# EAGLE design Amplifier (EAGLE 9.3.1)
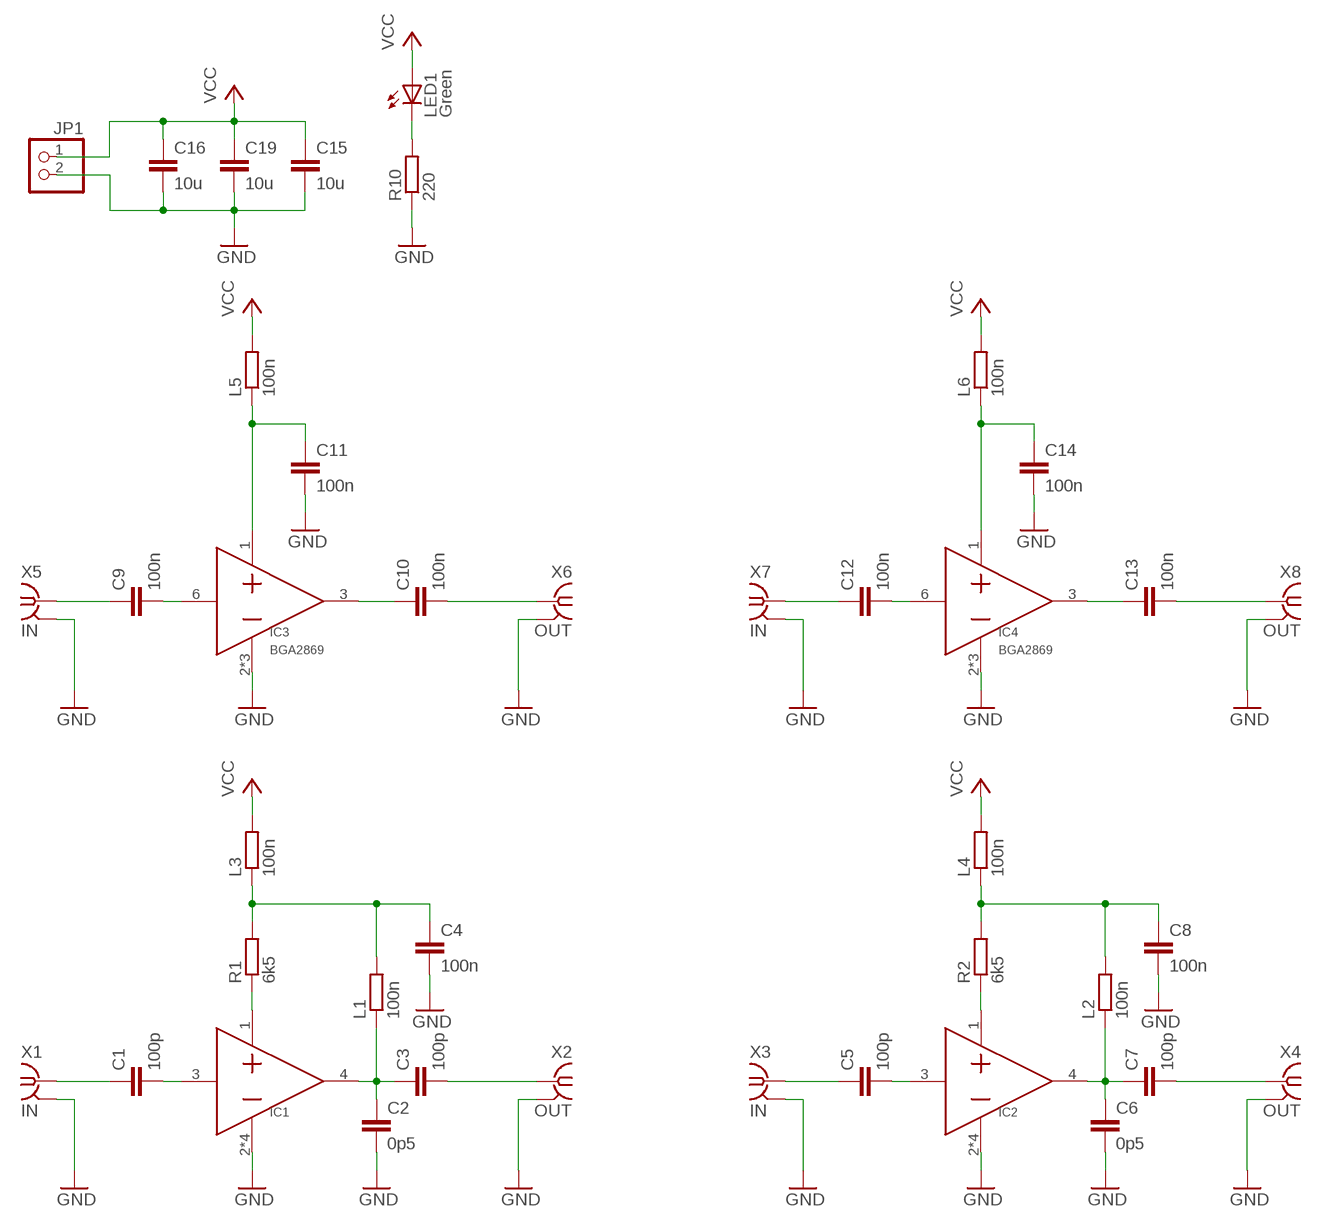
[diagram p0: schematic, sheet 1]

## Parts
C1  100p  C-EUC0603  [C0603]
C2  0p5  C-EUC0603  [C0603]
C3  100p  C-EUC0603  [C0603]
C4  100n  C-EUC0603  [C0603]
C5  100p  C-EUC0603  [C0603]
C6  0p5  C-EUC0603  [C0603]
C7  100p  C-EUC0603  [C0603]
C8  100n  C-EUC0603  [C0603]
C9  100n  C-EUC0603  [C0603]
C10  100n  C-EUC0603  [C0603]
C11  100n  C-EUC0603  [C0603]
C12  100n  C-EUC0603  [C0603]
C13  100n  C-EUC0603  [C0603]
C14  100n  C-EUC0603  [C0603]
C15  10u  C-EUC1206  [C1206]
C16  10u  C-EUC1206  [C1206]
C19  10u  C-EUC1206  [C1206]
IC1  GRF4002  [SON50P150X150X45-7T60X110]
IC2  GRF4002  [SON50P150X150X45-7T60X110]
IC3  BGA2869  [SOT363]
IC4  BGA2869  [SOT363]
JP1  PINHD-1X2/90  [1X02/90]
L1  100n  R-EU_R0603  [R0603]
L2  100n  R-EU_R0603  [R0603]
L3  100n  R-EU_R0603  [R0603]
L4  100n  R-EU_R0603  [R0603]
L5  100n  R-EU_R0603  [R0603]
L6  100n  R-EU_R0603  [R0603]
LED1  Green  LED_ESML0603  [LED_SML0603]
R1  6k5  R-EU_R0603  [R0603]
R2  6k5  R-EU_R0603  [R0603]
R10  220  R-EU_R0603  [R0603]
X1  IN  SMA_CONNECTOR  [J502-ND-142-0711-821/826]
X2  OUT  SMA_CONNECTOR  [J502-ND-142-0711-821/826]
X3  IN  SMA_CONNECTOR  [J502-ND-142-0711-821/826]
X4  OUT  SMA_CONNECTOR  [J502-ND-142-0711-821/826]
X5  IN  SMA_CONNECTOR  [J502-ND-142-0711-821/826]
X6  OUT  SMA_CONNECTOR  [J502-ND-142-0711-821/826]
X7  IN  SMA_CONNECTOR  [J502-ND-142-0711-821/826]
X8  OUT  SMA_CONNECTOR  [J502-ND-142-0711-821/826]

## Nets
GND: C2.2 C4.2 C6.2 C8.2 C11.2 C14.2 C15.2 C16.2 C19.2 IC1.2(GND) IC1.5(GND) IC1.6(GND) IC1.7(GND) IC2.2(GND) IC2.5(GND) IC2.6(GND) IC2.7(GND) IC3.2(GND) IC3.4(GND) IC3.5(GND) IC4.2(GND) IC4.4(GND) IC4.5(GND) JP1.2 R10.1 X1.G@1 X1.G@2 X1.G@3 X1.G@4 X2.G@1 X2.G@2 X2.G@3 X2.G@4 X3.G@1 X3.G@2 X3.G@3 X3.G@4 X4.G@1 X4.G@2 X4.G@3 X4.G@4 X5.G@1 X5.G@2 X5.G@3 X5.G@4 X6.G@1 X6.G@2 X6.G@3 X6.G@4 X7.G@1 X7.G@2 X7.G@3 X7.G@4 X8.G@1 X8.G@2 X8.G@3 X8.G@4
N$1 [RF]: C1.1 X1.1
N$2 [RF]: C1.2 IC1.3(IN)
N$3: IC1.1(VCC) R1.1
N$4 [RF]: C2.1 C3.1 IC1.4(OUT) L1.1
N$5 [RF]: C3.2 X2.1
N$6 [RF]: C5.1 X3.1
N$7 [RF]: C5.2 IC2.3(IN)
N$8: IC2.1(VCC) R2.1
N$9 [RF]: C6.1 C7.1 IC2.4(OUT) L2.1
N$10 [RF]: C7.2 X4.1
N$11 [RF]: C9.1 X5.1
N$12 [RF]: C9.2 IC3.6(IN)
N$13 [RF]: C12.1 X7.1
N$14 [RF]: C10.1 IC3.3(OUT)
N$15 [RF]: C10.2 X6.1
N$16 [RF]: C12.2 IC4.6(IN)
N$17 [RF]: C13.1 IC4.3(OUT)
N$18 [RF]: C13.2 X8.1
N$19: C4.1 L1.2 L3.1 R1.2
N$20: C8.1 L2.2 L4.1 R2.2
N$21: C11.1 IC3.1(VCC) L5.1
N$22: C14.1 IC4.1(VCC) L6.1
N$29: LED1.C R10.2
VCC: C15.1 C16.1 C19.1 JP1.1 L3.2 L4.2 L5.2 L6.2 LED1.A

## Library data of the parts
C1-C16 C19 = rcl:C-EU: CAPACITOR, European symbol
IC1 IC2 = rf:GRF4002
IC3 IC4 = rf:BGA2869
JP1 = pinhead:PINHD-1X2: PIN HEADER
L1-L6 R1 R2 R10 = resistor:R-EU_: RESISTOR, European symbol
LED1 = eagle-ltspice:LED_E: LED Source: http://www.osram.convergy.de Source: www.luxeon.com Source: www.kingbright.com; SPICEMODEL: NONE; SPICEPREFIX: D; SPICETYPE: diode
X1-X8 = rf:SMA_CONNECTOR

## Net classes
1 RF: width 0.3 mm

## Board
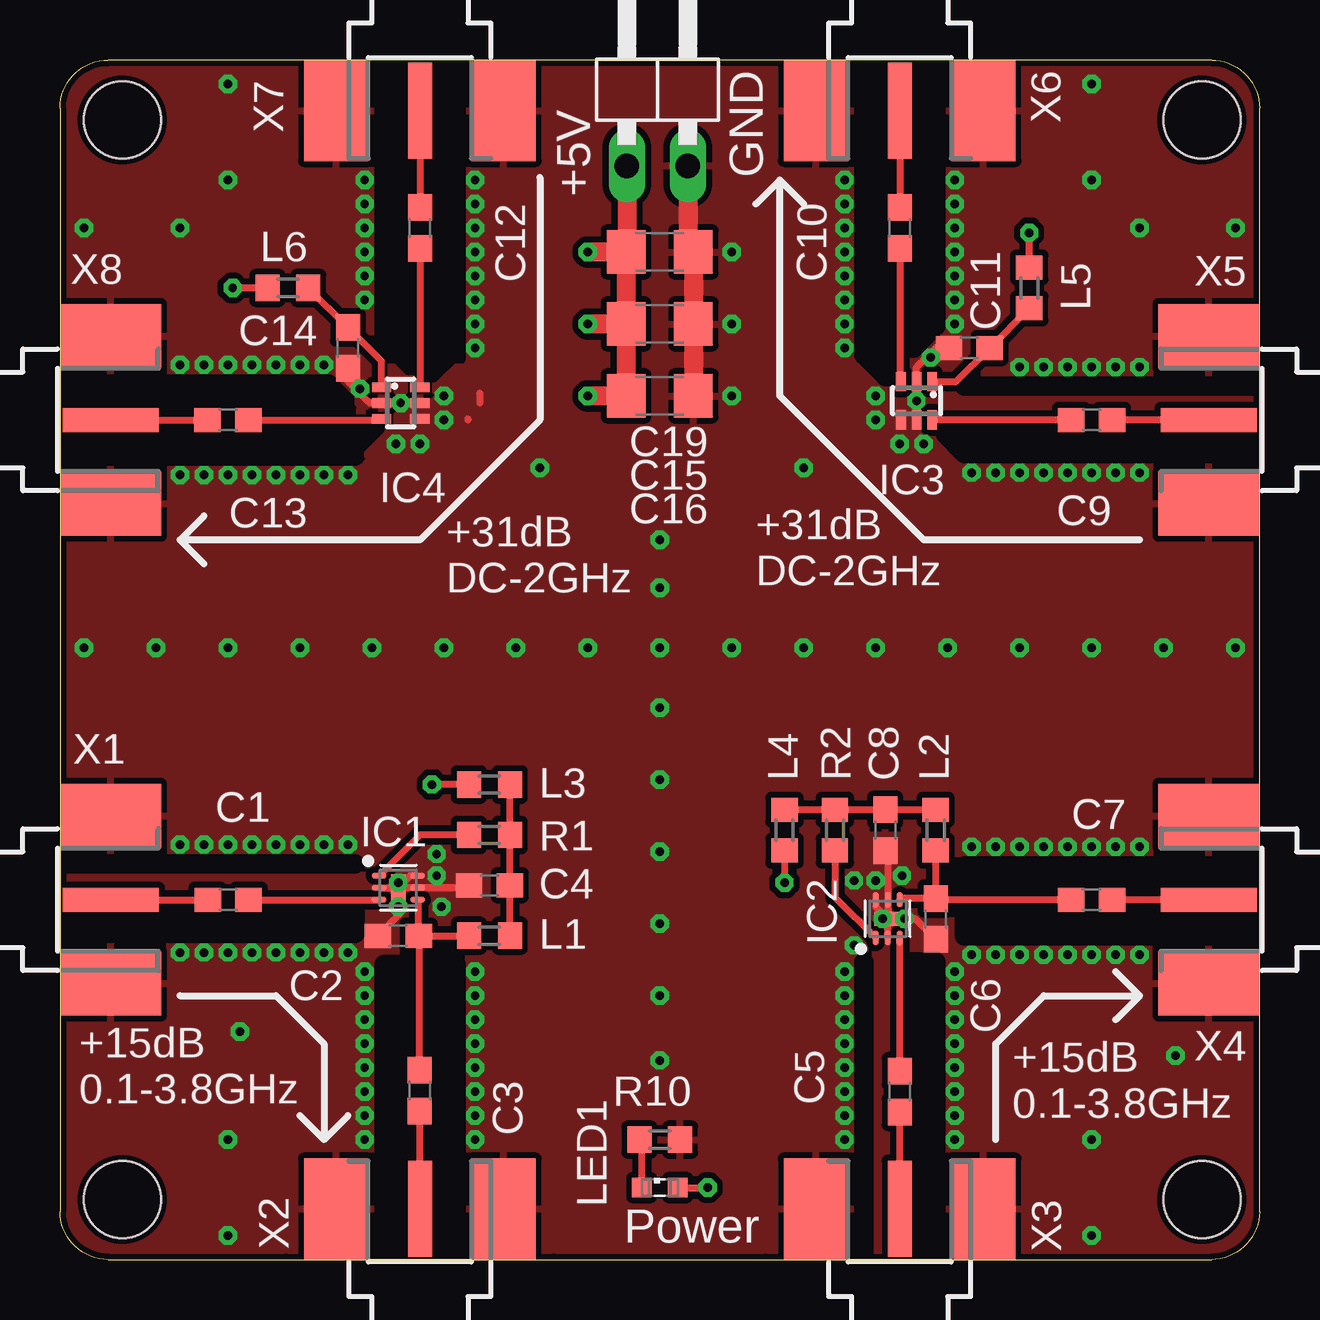
[diagram p1: board, top side]
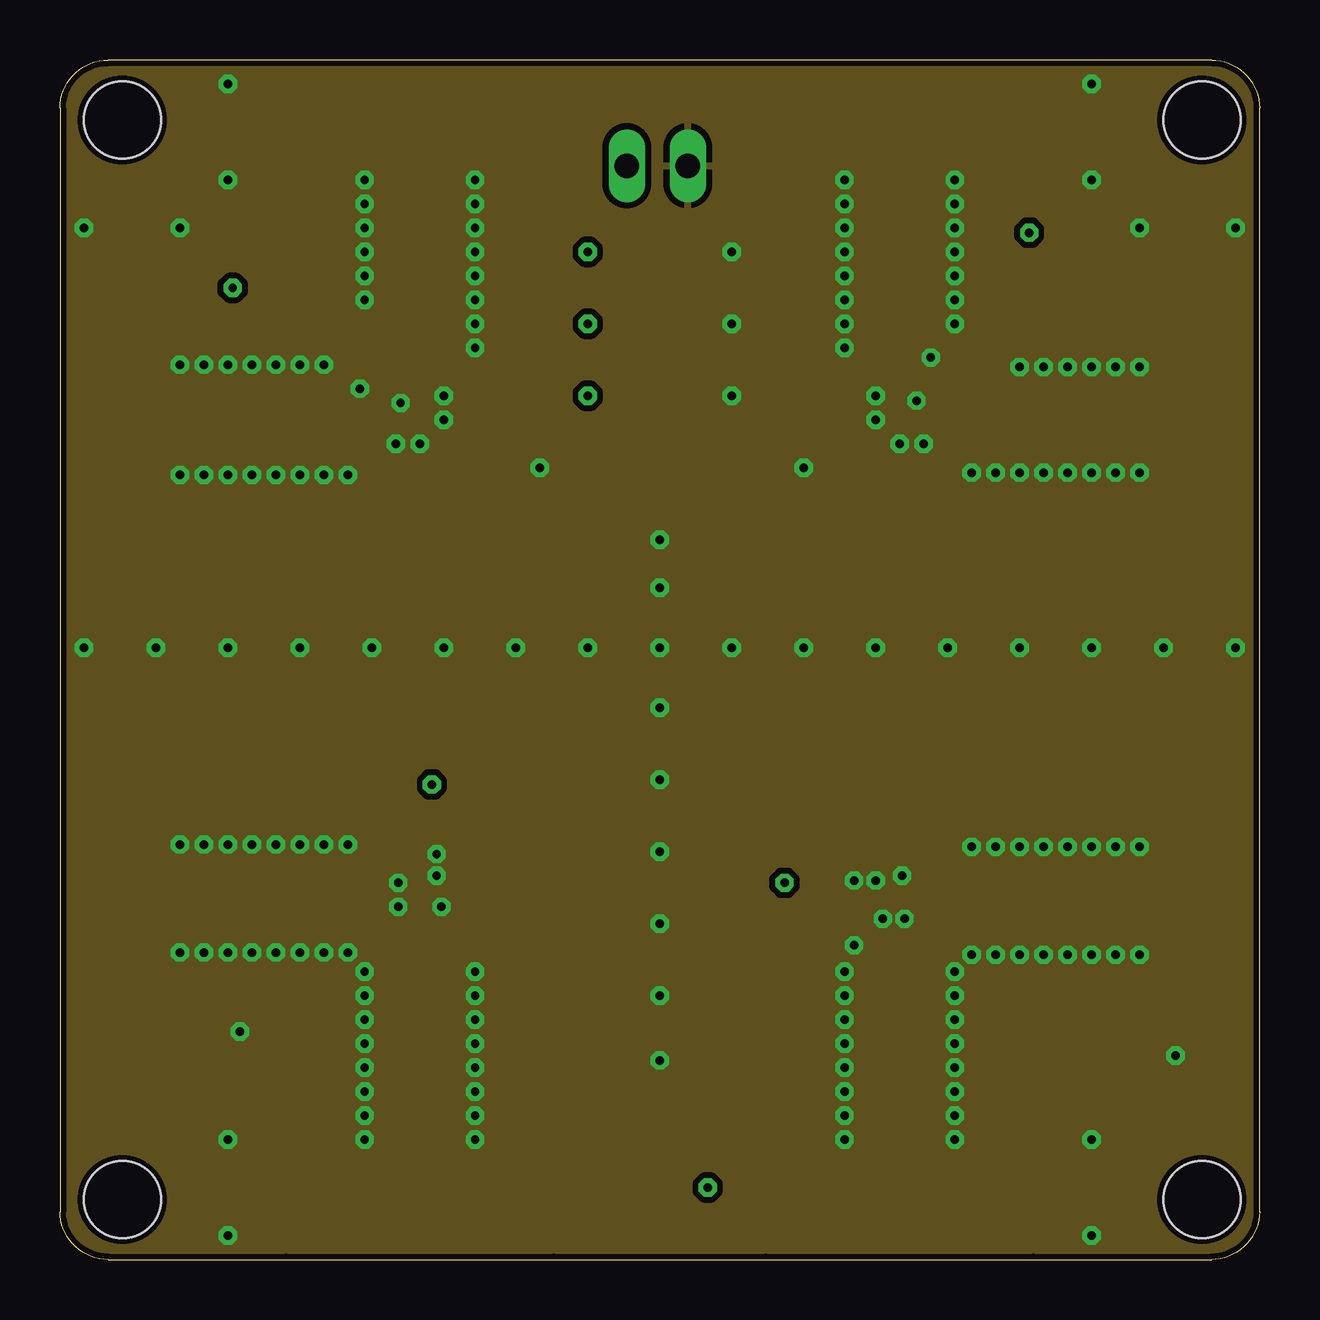
[diagram p2: board, inner layer Route2]
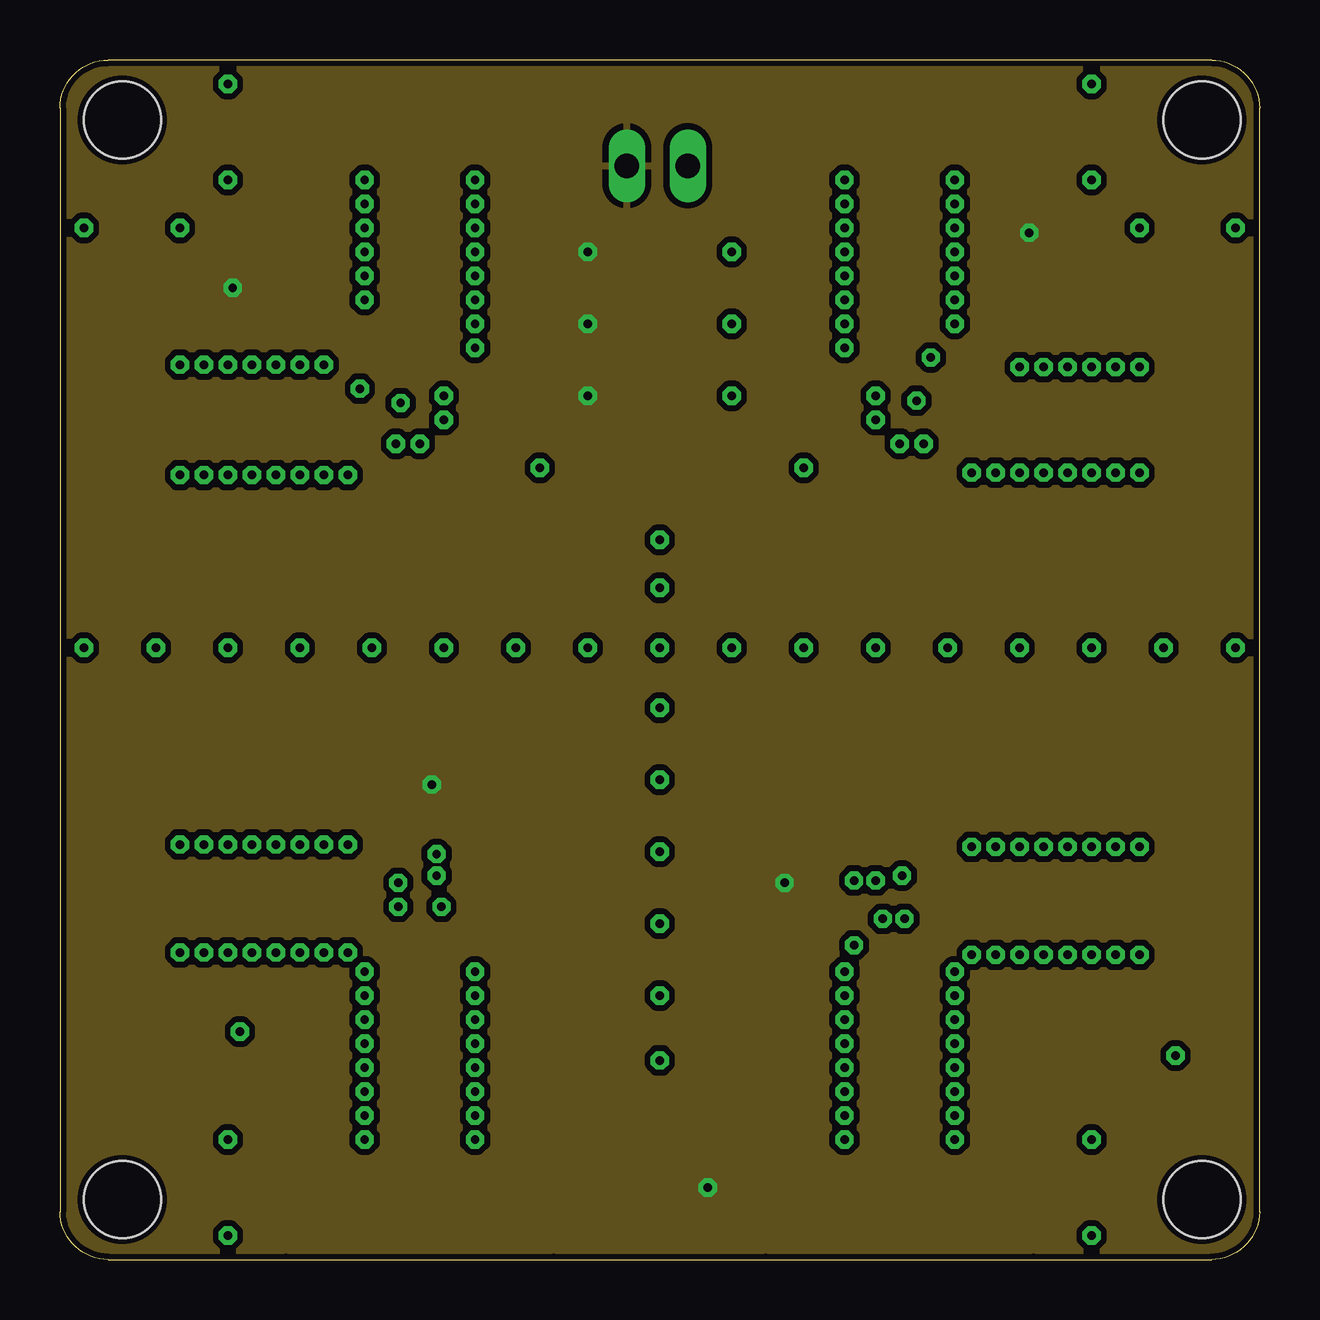
[diagram p3: board, inner layer Route15]
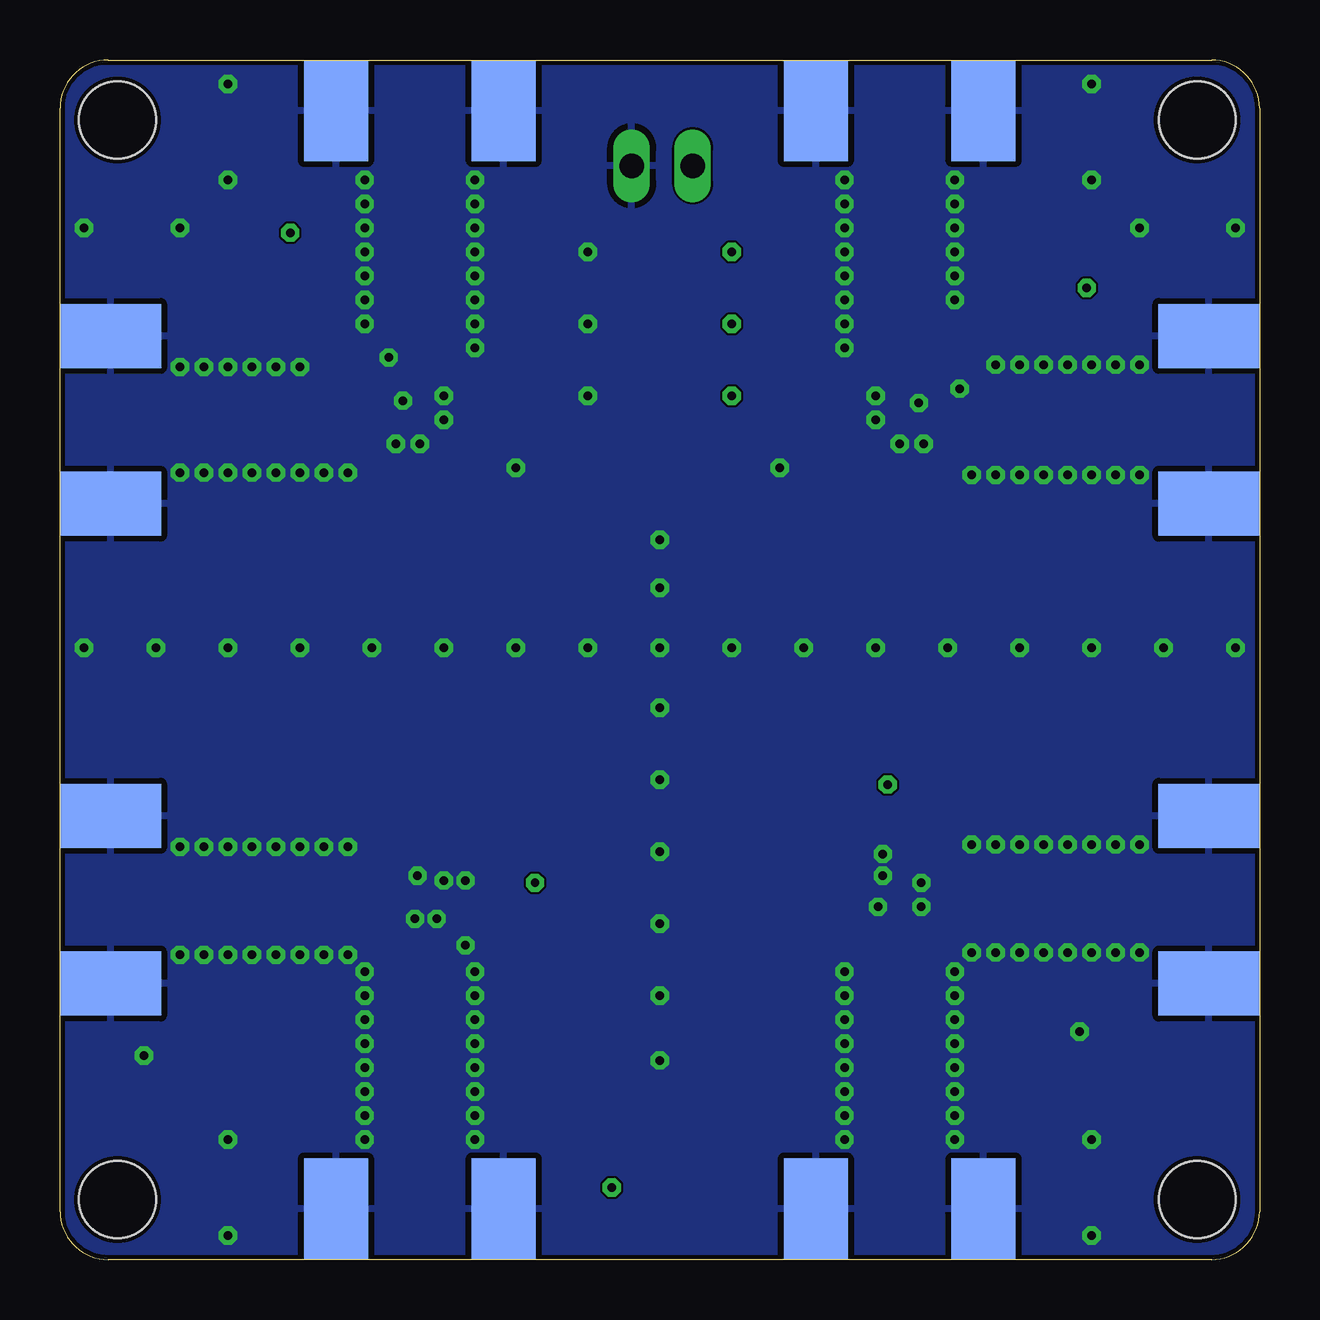
[diagram p4: board, bottom side, seen from below]

Size 50 x 50 mm. Coordinates in mm from the lower left corner, seen from the top.
Outline: 0,48 0,2 arc90 2,0 48,0 arc90 50,2 50,48 arc90 48,50 2,50 arc90 0,48
Copper layers (1+2*15+16): Top 0.035mm / dielectric 0.2mm / Route2 0.0175mm / dielectric 1.064mm / Route15 0.0175mm / dielectric 0.2mm / Bottom 0.035mm
Design rules "JLCPCB4L_7628": minimum track width 6mil, minimum drill 0.3mm, track to track 3.5mil, track to pad 3.5mil, pad to pad 3.5mil, via to via 3.5mil, smd to smd 0mil, copper to edge 0.2mm, drill to drill 0.2mm, minimum pad ring 10mil, minimum via ring 8mil, stop-mask expansion 4mil, vias tented up to drill 0mil, thermal gap 10mil
Holes 3.2 mm at 2.6,47.5 47.6,47.5 47.6,2.5 2.6,2.5
tRestrict: 27 lines

### Footprints (pad centres in the part's own frame; a part is rotated, then mirrored left to right if it is on the bottom)
C0603 = smd 1.1 x 1: 1 -0.85,0; 2 0.85,0
C1206 = smd 1.6 x 1.8: 1 -1.4,0; 2 1.4,0
SON50P150X150X45-7T60X110 = smd 0.612 x 0.232: 1 -0.8,0.5; 2 -0.8,0; 3 -0.8,-0.5; 4 0.8,-0.5; 5 0.8,0; 6 0.8,0.5 | smd 0.6 x 1.1: 7 0,0
SOT363 = smd 0.4 x 0.8: 1 -0.65,-0.8; 2 0,-0.8; 3 0.65,-0.8; 4 0.65,0.8; 5 0,0.8; 6 -0.65,0.8
1X02/90 = drill 1.016 long: 1 -1.27,-3.81; 2 1.27,-3.81
R0603 = smd 1 x 1.1: 1 -0.85,0; 2 0.85,0
LED_SML0603 = smd 0.8 x 0.8: A 0.75,0; C -0.75,0
J502-ND-142-0711-821/826 = smd 4 x 1: 1 2.115,0 | smd 4.191 x 2.667: G@1 2.115,3.495; G@2 2.115,-3.495 | smd 4.191 x 2.667 bottom: G@3 2.115,3.495; G@4 2.115,-3.495

### Placement (x,y rotation side)
C1  7.01,14.99 0 top
C2  14.1,13.5 180 top
C3  14.99,7.04 270 top
C4  17.9,15.6 180 top
C5  35,7 90 top
C6  36.5,14.2 270 top
C7  43,15 0 top
C8  34.4,17.9 270 top
C9  43,35 180 top
C10  35,43 90 top
C11  37.9,38 180 top
C12  15,43 270 top
C13  7,35 180 top
C14  12,38 270 top
C15  25,39 0 top
C16  25,36 0 top
C19  25,42 0 top
IC1  14.1,15.5 0 top
IC2  34.5,14.2 90 top
IC3  35.7,35.8 180 top
IC4  14.2,35.7 270 top
JP1  24.9,49.4 0 top
L1  17.9,13.5 0 top
L2  36.5,17.9 90 top
L3  17.9,19.8 180 top
L4  30.2,17.9 270 top
L5  40.4,40.5 90 top
L6  9.5,40.5 180 top
LED1  25,3 0 top
R1  17.9,17.7 0 top
R2  32.3,17.9 90 top
R10  25,5 180 top
X1  0,15 0 top
X2  15,0 90 top
X3  35,0 90 top
X4  50,15 180 top
X5  50,35 180 top
X6  35,50 270 top
X7  15,50 270 top
X8  0,35 0 top

### Tracks (layer width: path | path; a pad name or v marks a point on that pad's centre or on a via)
GND  (via drill 0.35)
  Top 0.3: C8.2 34.5,16.95 IC2.5 IC2.7 | C4.2 16.95,15.5 IC1.5 IC1.7 | IC3.2 35.7,37.2 36.5,38 C11.2 | IC4.2 12.9,35.7 12,36.6 C14.2 | 17.5,35.7 17.5,36.1 | 17,35.05 17,35 | IC2.2 IC2.7 | IC2.7 35.65,14.2 C6.2 | IC1.7 14.1,14.35 C2.2 | IC1.2 IC1.7 | IC1.6 14.59,16 IC1.7 | IC2.6 34,14.7 IC2.7
  Top 0.8: JP1.2 26.17,42.23 C19.2 C15.2 C16.2
  other vias: 28,39 28,36 34.3,14.2 35.2,14.2 14.1,15.7 14.1,14.7 14.2,35.7 35.7,35.8 36.3,37.6 12.5,36.3 14,34 15,34 16,35 16,36 36,34 35,34 34,35 34,36 15.7,16.9 15.7,16 15.9,14.7 33.1,15.8 34,15.8 35.1,16 37.3,5 37.3,6 37.3,7 37.3,8 37.3,9 37.3,10 37.3,11 37.3,12 38,12.7 39,12.7 40,12.7 41,12.7 42,12.7 43,12.7 44,12.7 45,12.7 45,17.2 44,17.2 43,17.2 42,17.2 41,17.2 40,17.2 39,17.2 38,17.2 32.7,5 32.7,6 32.7,7 32.7,8 32.7,9 32.7,10 32.7,11 32.7,12 33.1,13.1 11,37.3 10,37.3 9,37.3 8,37.3 7,37.3 6,37.3 5,37.3 12.7,40 12.7,41 12.7,42 12.7,43 12.7,44 12.7,45 17.3,38 17.3,39 17.3,40 17.3,41 17.3,42 17.3,43 17.3,44 17.3,45 12,32.7 11,32.7 10,32.7 9,32.7 8,32.7 7,32.7 6,32.7 5,32.7 32.7,45 32.7,44 32.7,43 32.7,42 32.7,41 32.7,40 32.7,39 32.7,38 37.3,39 37.3,40 37.3,41 37.3,42 37.3,43 37.3,44 37.3,45 45,37.2 44,37.2 43,37.2 42,37.2 41,37.2 40,37.2 45,32.8 44,32.8 43,32.8 42,32.8 41,32.8 40,32.8 39,32.8 38,32.8 12,17.3 11,17.3 10,17.3 9,17.3 8,17.3 7,17.3 6,17.3 5,17.3 12,12.8 11,12.8 10,12.8 9,12.8 8,12.8 7,12.8 6,12.8 5,12.8 12.7,5 12.7,6 12.7,7 12.7,8 12.7,9 12.7,10 12.7,11 12.7,12 17.3,5 17.3,6 17.3,7 17.3,8 17.3,9 17.3,10 17.3,11 17.3,12 28,42 7,49 7,45 1,43 5,43 43,49 43,45 45,43 49,43 43,1 43,5 46.5,8.5 7,1 7,5 7.5,9.5 1,25.5 4,25.5 7,25.5 10,25.5 13,25.5 16,25.5 19,25.5 22,25.5 25,25.5 28,25.5 31,25.5 34,25.5 37,25.5 40,25.5 43,25.5 46,25.5 49,25.5 25,23 25,20 25,17 25,14 25,11 25,8.3 25,28 25,30 31,33 20,33
  pour Route2 (isolate 0.254): -2,53 53.8,53 53.8,-3.5 -2,-3.5
  pour Bottom: -0.7,52 52.3,52 52.3,-1.7 -0.7,-1.7
  pour Top (isolate 0.254): -2.4,53.5 55,53.5 55,-4.9 -2.4,-4.9
  pour Top: 15.1,31.9 18.2,35 18.2,35.9 16.9,37.2 13.7,37.2 12.4,35.9 12.4,33.9 14.4,31.9
  pour Top (isolate 0.254, no thermals): 11,19 18,19 18,12 11,12
  pour Top (isolate 0.254, no thermals): 31.4,17.7 38.4,17.7 38.4,10.7 31.4,10.7
  pour Top (isolate 0.254, no thermals): 32.7,39.8 39.7,39.8 39.7,32.8 32.7,32.8
  pour Top (isolate 0.254, no thermals): 10.4,39.8 17.4,39.8 17.4,32.8 10.4,32.8
N$1
  Top 0.3: X1.1 C1.1
N$2
  Top 0.3: C1.2 IC1.3
N$3
  Top 0.3: R1.1 15,17.7 IC1.1
N$4
  Top 0.3: C3.1 14.99,13.46 C2.1 | C2.1 14.95,14.95 IC1.4 | C2.1 L1.1
N$5
  Top 0.3: X2.1 C3.2
N$6
  Top 0.3: X3.1 C5.1
N$7
  Top 0.3: C5.2 IC2.3
N$8
  Top 0.3: R2.1 32.3,15.1 IC2.1
N$9
  Top 0.3: C7.1 36.55,15 C6.1 | C6.1 35.05,15.05 IC2.4 | C6.1 L2.1
N$10
  Top 0.3: X4.1 C7.2
N$11
  Top 0.3: X5.1 C9.1
N$12
  Top 0.3: C9.2 IC3.6
N$13
  Top 0.3: X7.1 C12.1
N$14
  Top 0.3: C10.1 35,36.65 IC3.3
N$15
  Top 0.3: X6.1 C10.2
N$16
  Top 0.3: C12.2 IC4.6
N$17
  Top 0.3: C13.1 13.35,35 IC4.3
N$18
  Top 0.3: X8.1 C13.2
N$19
  Top 0.3: L1.2 C4.1 R1.2 L3.1
N$20
  Top 0.3: L2.2 C8.1 R2.2 L4.1
N$21
  Top 0.3: IC3.1 37.35,36.6 C11.1 L5.1
N$22
  Top 0.3: IC4.1 13.4,37.45 C14.1 L6.1
N$29
  Top 0.3: LED1.C 24.25,4.9 R10.2
VCC  (via drill 0.35)
  Top 0.3: LED1.A v27,3 | L4.2 v30.2,15.7 | L3.2 v15.5,19.8 | L5.2 v40.4,42.8 | L6.2 v7.2,40.5
  Top 0.8: JP1.1 23.63,42.03 C19.1 | C19.1 C15.1 | C15.1 C16.1 v22,36 | C19.1 v22,42 | C15.1 v22,39
  pour Route15 (isolate 0.254): -1.2,52.4 52.9,52.4 52.9,-2.4 -1.2,-2.4 -1.2,52.3

### Text on the board
tPlace: GND | +5V | +31dB / DC-2GHz | +31dB / DC-2GHz | +15dB / 0.1-3.8GHz | +15dB / 0.1-3.8GHz | Power